# EAGLE design LED board (EAGLE 6.5.0)
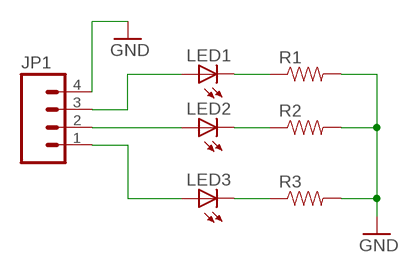
[diagram p0: schematic, sheet 1]

## Parts
JP1  M04LOCK  [1X04_LOCK]
LED1  LED3MM  [LED3MM]
LED2  LED3MM  [LED3MM]
LED3  LED3MM  [LED3MM]
R1  RESISTORPTH-1/6W  [1/6W-RES]
R2  RESISTORPTH-1/6W  [1/6W-RES]
R3  RESISTORPTH-1/6W  [1/6W-RES]

## Nets
GND: JP1.4 R1.2 R2.2 R3.2
N$1: JP1.3 LED1.A
N$2: JP1.2 LED2.A
N$3: JP1.1 LED3.A
N$4: LED1.K(C) R1.1
N$5: LED2.K(C) R2.1
N$6: LED3.K(C) R3.1

## Library data of the parts
JP1 = SparkFun-Connectors:M04: Header 4 Standard 4-pin 0.1" header. Use with straight break away headers (SKU : PRT-00116), right angle break away headers (PRT-00553), swiss pins (PRT-00743), machine pins (PRT-00117), and female headers (PRT-00115). Molex polarized connector foot print use with SKU : PRT-08231 with associated crimp pins and housings. 1MM SMD Version SKU: PRT-10208
LED1-LED3 = SparkFun-LED:LED: LEDs Standard schematic elements and footprints for 5mm, 3mm, 1206, and 0603 sized LEDs. 5mm - Spark Fun Electronics SKU : COM-00529 (and others)
R1-R3 = SparkFun-Passives:RESISTOR: Resistor Basic schematic elements and footprints for 0603, 1206, and PTH resistors.

## Board
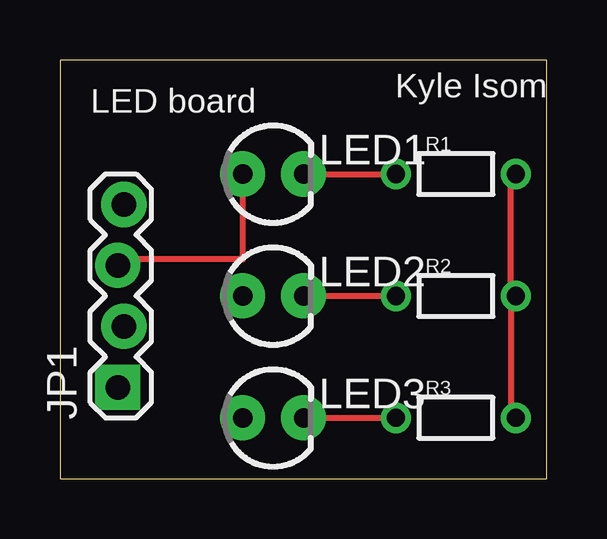
[diagram p1: board, top side]
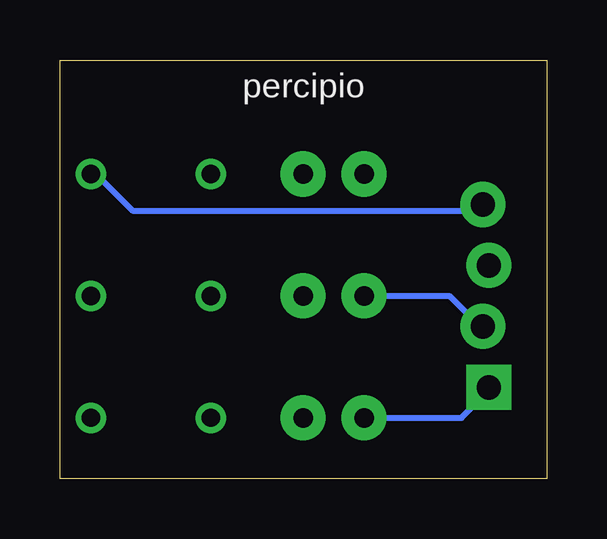
[diagram p2: board, bottom side, seen from below]

Size 20.3 x 17.45 mm. Coordinates in mm from the lower left corner, seen from the top.
Outline: 0,0 20.3,0 20.3,17.45 0,17.45 0,0
Copper layers (1*16): Top 0.035mm / dielectric 1.5mm / Bottom 0.035mm
Design rules "default": minimum track width 10mil, minimum drill 24mil, track to track 8mil, track to pad 8mil, pad to pad 8mil, via to via 8mil, smd to smd 8mil, copper to edge 40mil, drill to drill 8mil, minimum pad ring 10mil, minimum via ring 8mil, stop-mask expansion 4mil, vias tented up to drill 0mil, thermal gap 10mil

### Footprints (pad centres in the part's own frame; a part is rotated, then mirrored left to right if it is on the bottom)
1X04_LOCK = drill 1.016 pad 1.88 square: 1 0,0.127 | drill 1.016 pad 1.88: 2 2.54,-0.127; 3 5.08,0.127; 4 7.62,-0.127
LED3MM = drill 0.813 pad 1.88: A -1.27,0; K 1.27,0
1/6W-RES = drill 0.762: 1 -2.5,0; 2 2.5,0

### Placement (x,y rotation side)
JP1  2.54,3.81 90 top
LED1  8.89,12.7 0 top
LED2  8.89,7.62 0 top
LED3  8.89,2.54 0 top
R1  16.51,12.7 0 top
R2  16.51,7.62 0 top
R3  16.51,2.54 0 top

### Tracks (layer width: path | path; a pad name or v marks a point on that pad's centre or on a via)
GND
  Top 0.254: 18.8,7.62 18.8,2.54 R3.2 | 18.8,7.62 18.8,12.7 R1.2 | 18.8,7.62 R2.2
  Bottom 0.254: JP1.4 3.05,11.18 17.27,11.18 18.8,12.7 R1.2
N$1
  Top 0.254: LED1.A 7.62,9.14 2.54,9.14 JP1.3
N$2
  Bottom 0.254: LED2.A 4.06,7.62 3.05,6.6 JP1.2
N$3
  Bottom 0.254: LED3.A 3.56,2.54 2.54,3.56 JP1.1
N$4
  Top 0.254: LED1.K R1.1
N$5
  Top 0.254: LED2.K R2.1
N$6
  Top 0.254: LED3.K R3.1

### Text on the board
tPlace: Kyle Isom | LED board
bPlace: percipio